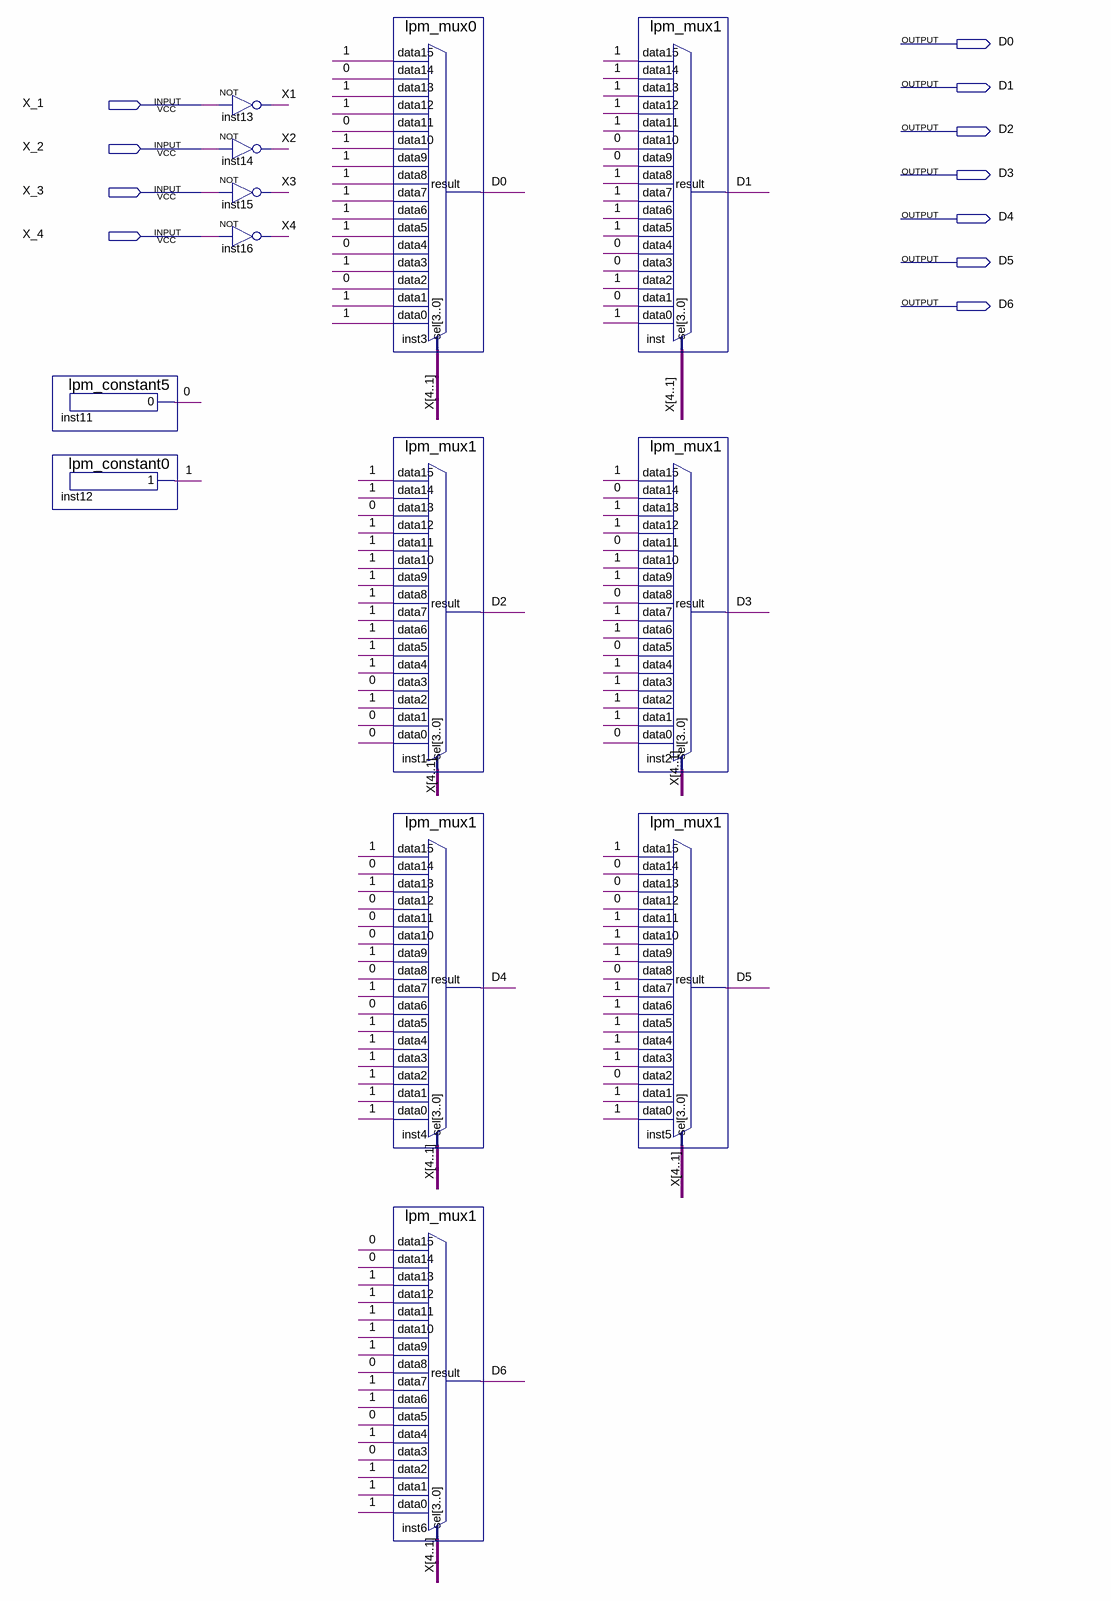
[diagram p0: schematic sheet]
// Quartus schematic Lab2.bdf as structural Verilog: 13 symbols, 11 pins
module Lab2 (
  input  X_1,
  input  X_2,
  input  X_3,
  input  X_4,
  output D0,
  output D1,
  output D2,
  output D3,
  output D4,
  output D5,
  output D6
);

  wire \0 , \1 ;
  wire [4:1] X;

  lpm_constant5 inst11 (.result(\0 ));
  lpm_constant0 inst12 (.result(\1 ));
  not inst13 (X[1], X_1);
  not inst14 (X[2], X_2);
  not inst15 (X[3], X_3);
  not inst16 (X[4], X_4);
  lpm_mux0 inst3 (
    .data15(\1 ), .data14(\0 ), .data13(\1 ), .data12(\1 ), .data11(\0 ), .data10(\1 ), .data9(\1 ),
    .data8(\1 ), .data7(\1 ), .data6(\1 ), .data5(\1 ), .data4(\0 ), .data3(\1 ), .data2(\0 ), .data1(\1 ),
    .data0(\1 ), .sel(X), .result(D0));
  lpm_mux1 inst1 (
    .data15(\1 ), .data14(\1 ), .data13(\0 ), .data12(\1 ), .data11(\1 ), .data10(\1 ), .data9(\1 ),
    .data8(\1 ), .data7(\1 ), .data6(\1 ), .data5(\1 ), .data4(\1 ), .data3(\0 ), .data2(\1 ), .data1(\0 ),
    .data0(\0 ), .sel(X), .result(D2));
  lpm_mux1 inst4 (
    .data15(\1 ), .data14(\0 ), .data13(\1 ), .data12(\0 ), .data11(\0 ), .data10(\0 ), .data9(\1 ),
    .data8(\0 ), .data7(\1 ), .data6(\0 ), .data5(\1 ), .data4(\1 ), .data3(\1 ), .data2(\1 ), .data1(\1 ),
    .data0(\1 ), .sel(X), .result(D4));
  lpm_mux1 inst6 (
    .data15(\0 ), .data14(\0 ), .data13(\1 ), .data12(\1 ), .data11(\1 ), .data10(\1 ), .data9(\1 ),
    .data8(\0 ), .data7(\1 ), .data6(\1 ), .data5(\0 ), .data4(\1 ), .data3(\0 ), .data2(\1 ), .data1(\1 ),
    .data0(\1 ), .sel(X), .result(D6));
  lpm_mux1 inst (
    .data15(\1 ), .data14(\1 ), .data13(\1 ), .data12(\1 ), .data11(\1 ), .data10(\0 ), .data9(\0 ),
    .data8(\1 ), .data7(\1 ), .data6(\1 ), .data5(\1 ), .data4(\0 ), .data3(\0 ), .data2(\1 ), .data1(\0 ),
    .data0(\1 ), .sel(X), .result(D1));
  lpm_mux1 inst2 (
    .data15(\1 ), .data14(\0 ), .data13(\1 ), .data12(\1 ), .data11(\0 ), .data10(\1 ), .data9(\1 ),
    .data8(\0 ), .data7(\1 ), .data6(\1 ), .data5(\0 ), .data4(\1 ), .data3(\1 ), .data2(\1 ), .data1(\1 ),
    .data0(\0 ), .sel(X), .result(D3));
  lpm_mux1 inst5 (
    .data15(\1 ), .data14(\0 ), .data13(\0 ), .data12(\0 ), .data11(\1 ), .data10(\1 ), .data9(\1 ),
    .data8(\0 ), .data7(\1 ), .data6(\1 ), .data5(\1 ), .data4(\1 ), .data3(\1 ), .data2(\0 ), .data1(\1 ),
    .data0(\1 ), .sel(X), .result(D5));
endmodule
